# Altium schematic sheet Connectors.SchDoc
size A4
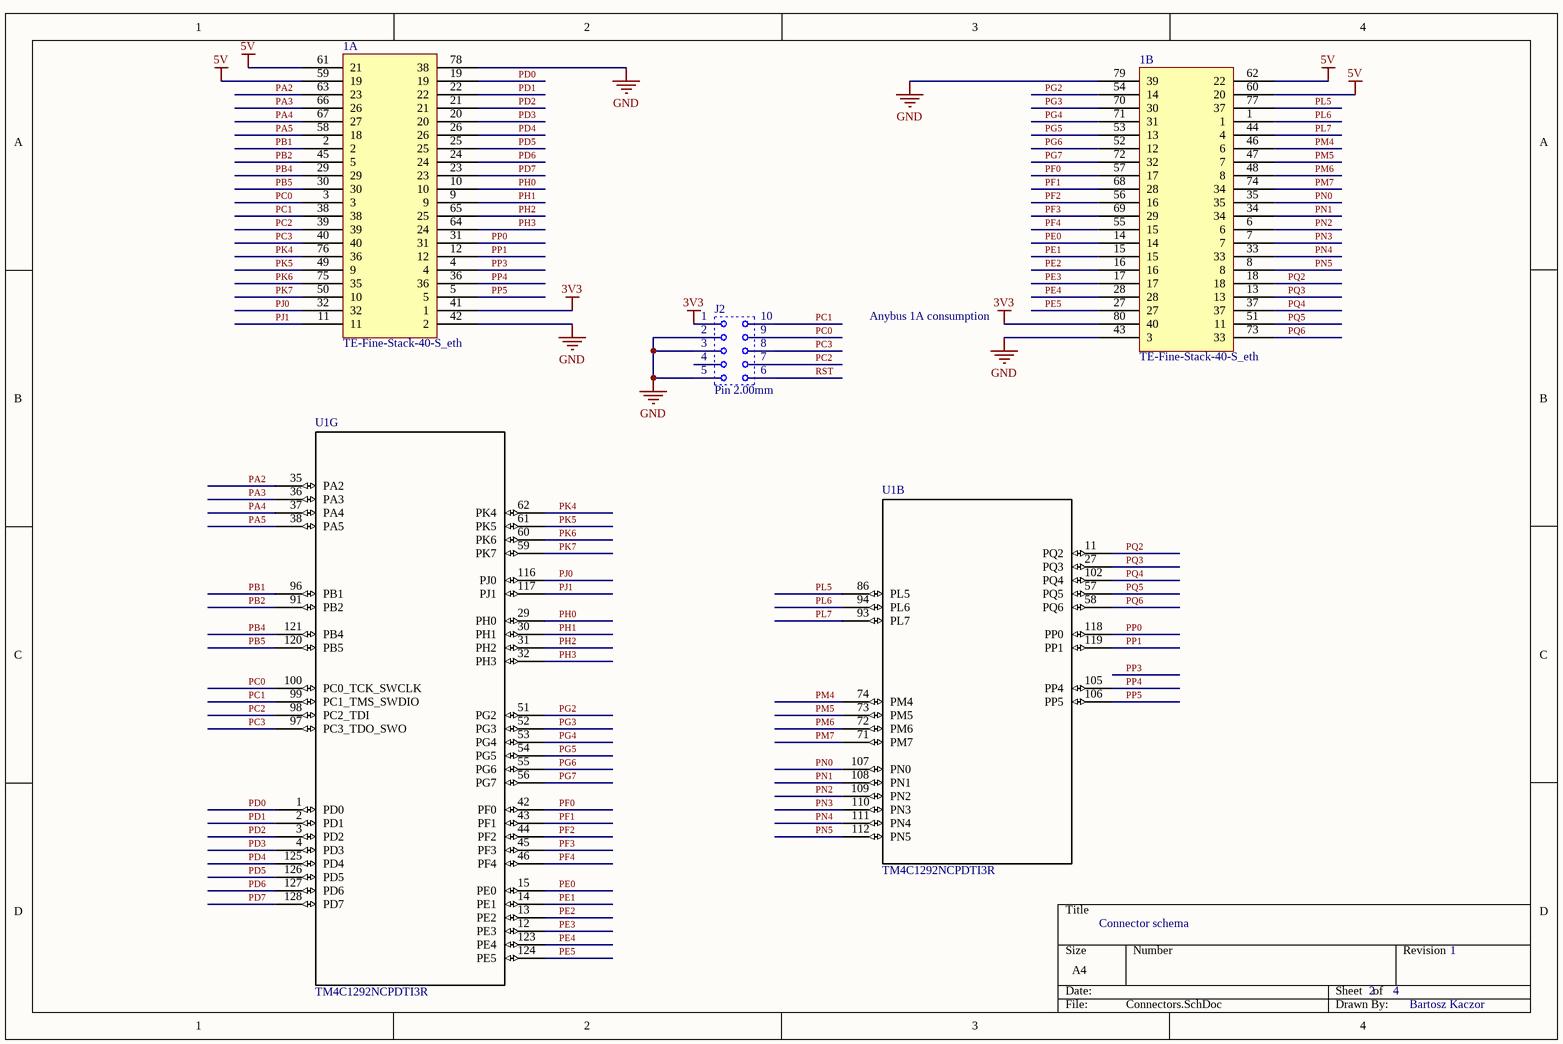
[diagram p0: Connectors.SchDoc]

## Parts
1  TE-Fine-Stack-40-S_eth  [TE-FINE-STACK-40-S-Eth]  (parts A,B of 2)
J2  Pin 2.00mm  [GOLDPIN 1.27MM SOCKET 2X5 SMD]
U1  TM4C1292NCPDTI3R  [PDT0128A_N]  (parts B,G of 7)

## Nets
3V3: 1.41(1) 1.80(40) J2.1
5V: 1.59(19) 1.60(20) 1.61(21) 1.62(22)
GND: 1.42(2) 1.43(3) 1.78(38) 1.79(39) J2.2 J2.3 J2.5
PA2: 1.63(23) U1.35(PA2)
PA3: 1.66(26) U1.36(PA3)
PA4: 1.67(27) U1.37(PA4)
PA5: 1.58(18) U1.38(PA5)
PB1: 1.2 U1.96(PB1)
PB2: 1.45(5) U1.91(PB2)
PB4: 1.29 U1.121(PB4)
PB5: 1.30 U1.120(PB5)
PC0: 1.3 J2.9 U1.100(PC0_TCK_SWCLK)
PC1: 1.38 J2.10 U1.99(PC1_TMS_SWDIO)
PC2: 1.39 J2.7 U1.98(PC2_TDI)
PC3: 1.40 J2.8 U1.97(PC3_TDO_SWO)
PD0: 1.19 U1.1(PD0)
PD1: 1.22 U1.2(PD1)
PD2: 1.21 U1.3(PD2)
PD3: 1.20 U1.4(PD3)
PD4: 1.26 U1.125(PD4)
PD5: 1.25 U1.126(PD5)
PD6: 1.24 U1.127(PD6)
PD7: 1.23 U1.128(PD7)
PE0: 1.14 U1.15(PE0)
PE1: 1.15 U1.14(PE1)
PE2: 1.16 U1.13(PE2)
PE3: 1.17 U1.12(PE3)
PE4: 1.28 U1.123(PE4)
PE5: 1.27 U1.124(PE5)
PF0: 1.57(17) U1.42(PF0)
PF1: 1.68(28) U1.43(PF1)
PF2: 1.56(16) U1.44(PF2)
PF3: 1.69(29) U1.45(PF3)
PF4: 1.55(15) U1.46(PF4)
PG2: 1.54(14) U1.51(PG2)
PG3: 1.70(30) U1.52(PG3)
PG4: 1.71(31) U1.53(PG4)
PG5: 1.53(13) U1.54(PG5)
PG6: 1.52(12) U1.55(PG6)
PG7: 1.72(32) U1.56(PG7)
PH0: 1.10 U1.29(PH0)
PH1: 1.9 U1.30(PH1)
PH2: 1.65(25) U1.31(PH2)
PH3: 1.64(24) U1.32(PH3)
PJ0: 1.32 U1.116(PJ0)
PJ1: 1.11 U1.117(PJ1)
PK4: 1.76(36) U1.62(PK4)
PK5: 1.49(9) U1.61(PK5)
PK6: 1.75(35) U1.60(PK6)
PK7: 1.50(10) U1.59(PK7)
PL5: 1.77(37) U1.86(PL5)
PL6: 1.1 U1.94(PL6)
PL7: 1.44(4) U1.93(PL7)
PM4: 1.46(6) U1.74(PM4)
PM5: 1.47(7) U1.73(PM5)
PM6: 1.48(8) U1.72(PM6)
PM7: 1.74(34) U1.71(PM7)
PN0: 1.35 U1.107(PN0)
PN1: 1.34 U1.108(PN1)
PN2: 1.6 U1.109(PN2)
PN3: 1.7 U1.110(PN3)
PN4: 1.33 U1.111(PN4)
PN5: 1.8 U1.112(PN5)
PP0: 1.31 U1.118(PP0)
PP1: 1.12 U1.119(PP1)
PP3: 1.4
PP4: 1.36 U1.105(PP4)
PP5: 1.5 U1.106(PP5)
PQ2: 1.18 U1.11(PQ2)
PQ3: 1.13 U1.27(PQ3)
PQ4: 1.37 U1.102(PQ4)
PQ5: 1.51(11) U1.57(PQ5)
PQ6: 1.73(33) U1.58(PQ6)
RST: J2.6

Not connected (* = marked no-connect by the designer): J2 4

## Notes on the sheet
- Anybus 1A consumption
- Connector schema
- 2      4
- 1
- Bartosz Kaczor

## Library data of the parts
J2 = Goldpin 1.27 socket 2x5: Symbol: NINIGI ZL265-16DG; URL: http://www.tme.eu/pl/details/zl265-16dg/listwy-i-gniazda-kolkowe/ninigi/#; Supplier: TME
U1 = TM4C1292NCPDTI3R: Imported; Manufacturer: Texas Instruments; CompType: IC; PIN_COUNT: 128; Application_BuildNumber: *; PartNumber: TM4C1292NCPDTI3R; Alternate PartNumber: TM4C1292NCPDTI3; PackageReference: PDT0128A; MountType: SMT; RoHS: Y; RefDes: RefDes; Type: DEV; Value: Value